# Altium schematic sheet Steering Wheel Interface Digital Inputs.SchDoc: Steering Wheel Interface - Digital Inputs
size B; Organization: Midnight Sun Solar Rayce Car Team; Address1: University of Waterloo; Address2: 200 University Ave W; Address3: Waterloo, ON, Canada; Address4: N2L 3E9; DocumentNumber: 3; SheetNumber: 3; SheetTotal: 3; Website: www.uwmidsun.com; ProjectName: ProjectName
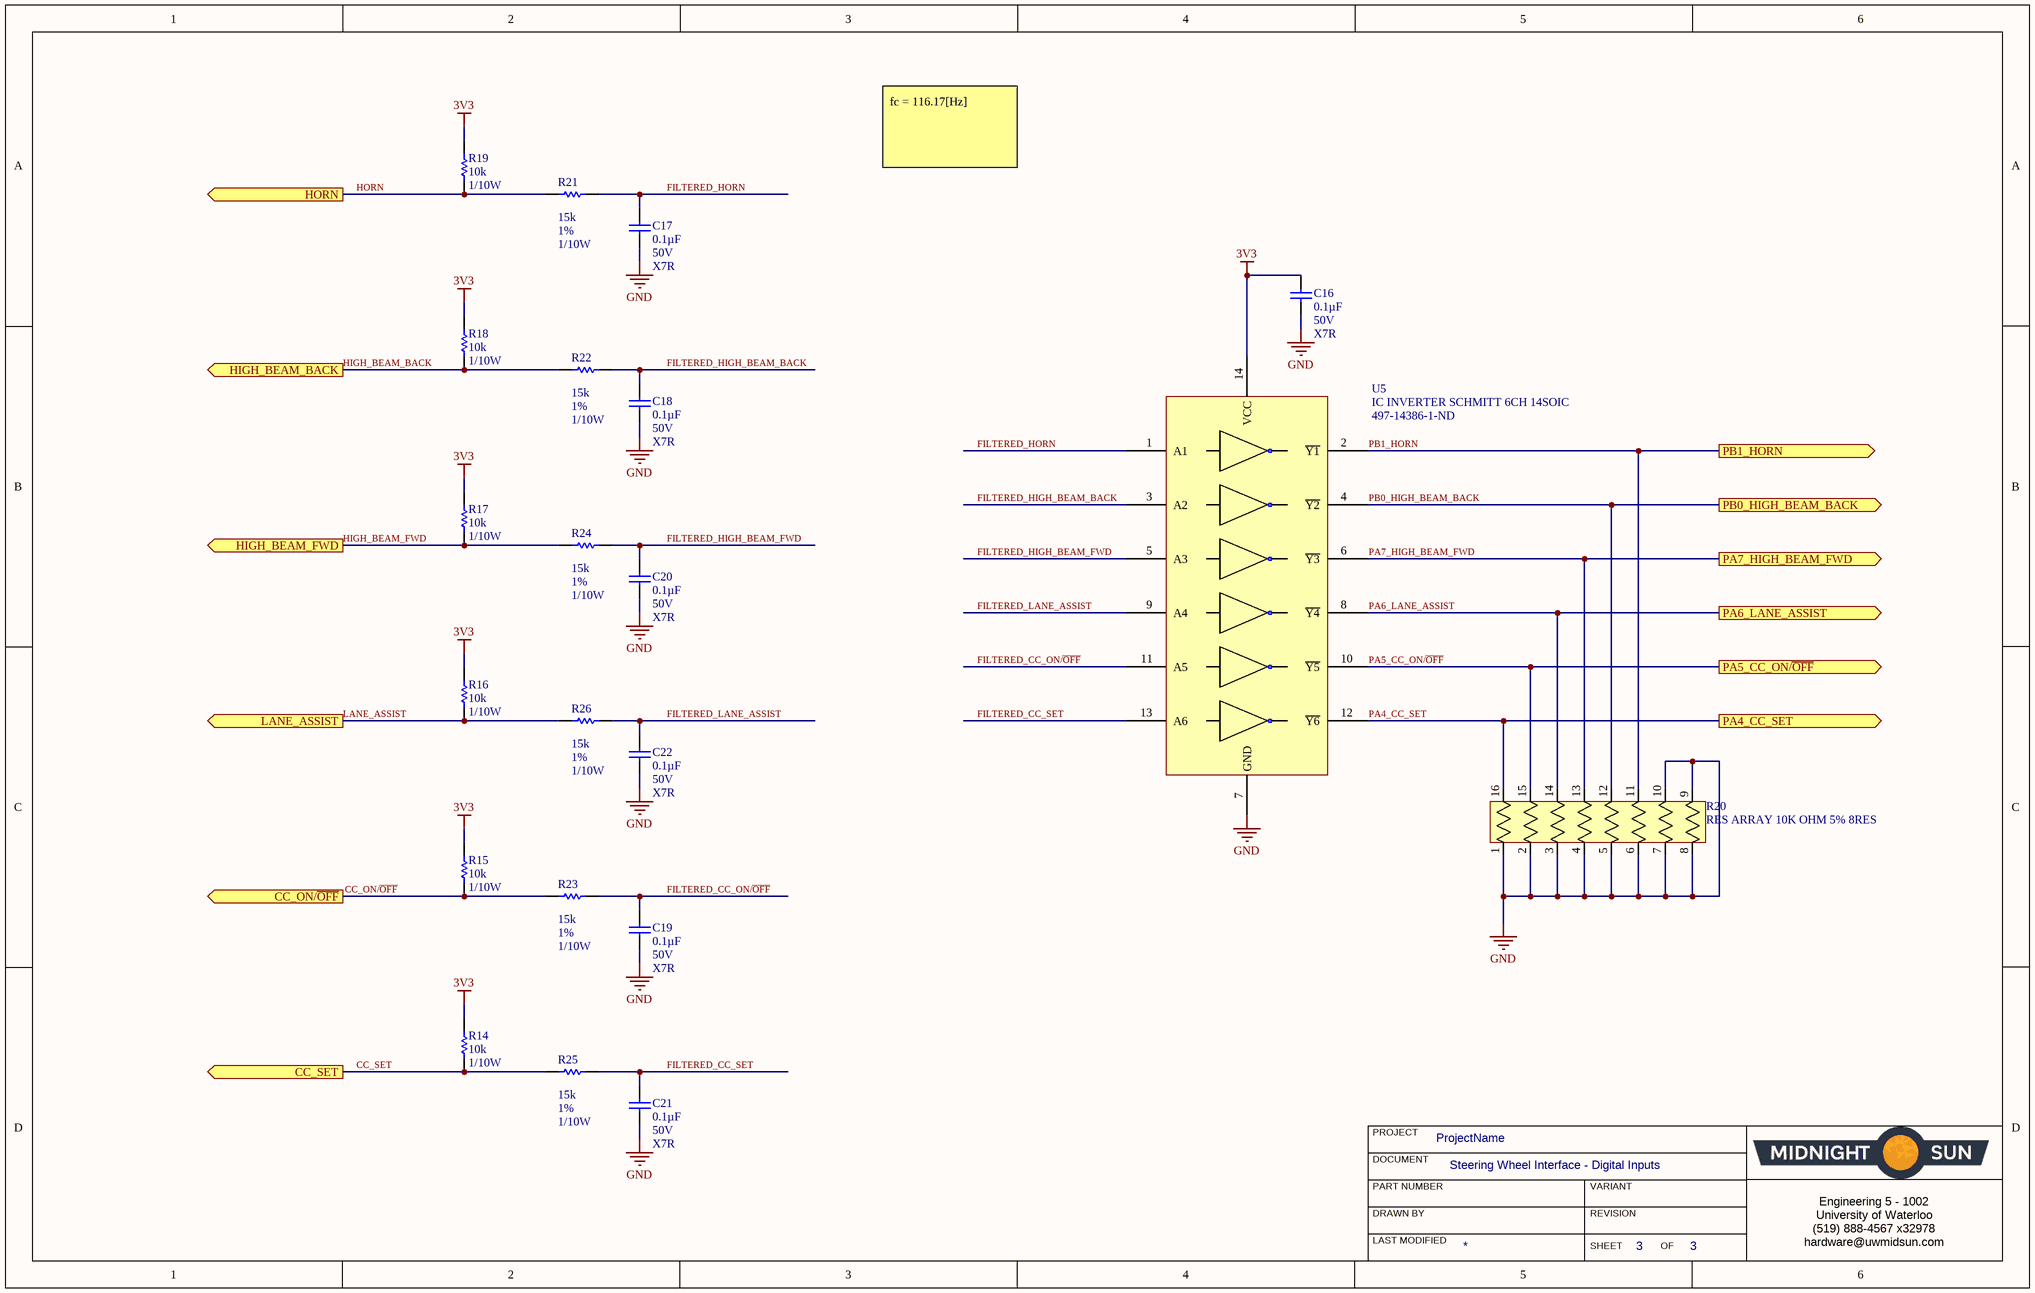
[diagram p0: Steering Wheel Interface Digital Inputs.SchDoc]

## Parts
C16  Capacitance: 0.1µF  Voltage: 50V  Temperature Coefficient: X7R  [CAP, 0603]  (hidden comment: CAP CER 0.1UF 50V 10% X7R 0603)
C17  Capacitance: 0.1µF  Voltage: 50V  Temperature Coefficient: X7R  [CAP, 0603]  (hidden comment: CAP CER 0.1UF 50V 10% X7R 0603)
C18  Capacitance: 0.1µF  Voltage: 50V  Temperature Coefficient: X7R  [CAP, 0603]  (hidden comment: CAP CER 0.1UF 50V 10% X7R 0603)
C19  Capacitance: 0.1µF  Voltage: 50V  Temperature Coefficient: X7R  [CAP, 0603]  (hidden comment: CAP CER 0.1UF 50V 10% X7R 0603)
C20  Capacitance: 0.1µF  Voltage: 50V  Temperature Coefficient: X7R  [CAP, 0603]  (hidden comment: CAP CER 0.1UF 50V 10% X7R 0603)
C21  Capacitance: 0.1µF  Voltage: 50V  Temperature Coefficient: X7R  [CAP, 0603]  (hidden comment: CAP CER 0.1UF 50V 10% X7R 0603)
C22  Capacitance: 0.1µF  Voltage: 50V  Temperature Coefficient: X7R  [CAP, 0603]  (hidden comment: CAP CER 0.1UF 50V 10% X7R 0603)
R14  Resistance: 10k  Power: 1/10W  [RES, 0603]  (hidden comment: RES 10K OHM 1% 1/10W 0603)
R15  Resistance: 10k  Power: 1/10W  [RES, 0603]  (hidden comment: RES 10K OHM 1% 1/10W 0603)
R16  Resistance: 10k  Power: 1/10W  [RES, 0603]  (hidden comment: RES 10K OHM 1% 1/10W 0603)
R17  Resistance: 10k  Power: 1/10W  [RES, 0603]  (hidden comment: RES 10K OHM 1% 1/10W 0603)
R18  Resistance: 10k  Power: 1/10W  [RES, 0603]  (hidden comment: RES 10K OHM 1% 1/10W 0603)
R19  Resistance: 10k  Power: 1/10W  [RES, 0603]  (hidden comment: RES 10K OHM 1% 1/10W 0603)
R20  RES ARRAY 10K OHM 5% 8RES  [RES ARRAY, 8 POS 1506]
R21  Resistance: 15k  Tolerance: 1%  Max Power Dissipation: 1/10W  [RES, 0603]  (hidden comment: RES SMD 15K OHM 1% 1/10W 0603)
R22  Resistance: 15k  Tolerance: 1%  Max Power Dissipation: 1/10W  [RES, 0603]  (hidden comment: RES SMD 15K OHM 1% 1/10W 0603)
R23  Resistance: 15k  Tolerance: 1%  Max Power Dissipation: 1/10W  [RES, 0603]  (hidden comment: RES SMD 15K OHM 1% 1/10W 0603)
R24  Resistance: 15k  Tolerance: 1%  Max Power Dissipation: 1/10W  [RES, 0603]  (hidden comment: RES SMD 15K OHM 1% 1/10W 0603)
R25  Resistance: 15k  Tolerance: 1%  Max Power Dissipation: 1/10W  [RES, 0603]  (hidden comment: RES SMD 15K OHM 1% 1/10W 0603)
R26  Resistance: 15k  Tolerance: 1%  Max Power Dissipation: 1/10W  [RES, 0603]  (hidden comment: RES SMD 15K OHM 1% 1/10W 0603)
U5  IC INVERTER SCHMITT 6CH 14SOIC  Supplier Part Number 1: 497-14386-1-ND  [IC INVERTER SCHMITT 6CH 14TSSOP]

## Ports
CC_ON/~{OFF} (out), CC_SET (out), HIGH_BEAM_BACK (out), HIGH_BEAM_FWD (out), HORN (out), LANE_ASSIST (out), PA4_CC_SET (out), PA5_CC_ON/~{OFF} (out), PA6_LANE_ASSIST (out), PA7_HIGH_BEAM_FWD (out), PB0_HIGH_BEAM_BACK (out), PB1_HORN (out)

## Nets
3V3: C16.1 R14.1 R15.1 R16.1 R17.1 R18.1 R19.1 U5.14(VCC)
GND: C16.2 C17.2 C18.2 C19.2 C20.2 C21.2 C22.2 R20.1 R20.2 R20.3 R20.4 R20.5 R20.6 R20.7 R20.8 R20.9 R20.10 U5.7(GND)
CC_ON/~{OFF}: R15.2 R23.2 ; port CC_ON/~{OFF}
CC_SET: R14.2 R25.2 ; port CC_SET
FILTERED_CC_ON/~{OFF}: C19.1 R23.1 U5.11(A5)
FILTERED_CC_SET: C21.1 R25.1 U5.13(A6)
FILTERED_HIGH_BEAM_BACK: C18.1 R22.1 U5.3(A2)
FILTERED_HIGH_BEAM_FWD: C20.1 R24.1 U5.5(A3)
FILTERED_HORN: C17.1 R21.1 U5.1(A1)
FILTERED_LANE_ASSIST: C22.1 R26.1 U5.9(A4)
HIGH_BEAM_BACK: R18.2 R22.2 ; port HIGH_BEAM_BACK
HIGH_BEAM_FWD: R17.2 R24.2 ; port HIGH_BEAM_FWD
HORN: R19.2 R21.2 ; port HORN
LANE_ASSIST: R16.2 R26.2 ; port LANE_ASSIST
PA4_CC_SET: R20.16 U5.12(~{Y6}) ; port PA4_CC_SET
PA5_CC_ON/~{OFF}: R20.15 U5.10(~{Y5}) ; port PA5_CC_ON/~{OFF}
PA6_LANE_ASSIST: R20.14 U5.8(~{Y4}) ; port PA6_LANE_ASSIST
PA7_HIGH_BEAM_FWD: R20.13 U5.6(~{Y3}) ; port PA7_HIGH_BEAM_FWD
PB0_HIGH_BEAM_BACK: R20.12 U5.4(~{Y2}) ; port PB0_HIGH_BEAM_BACK
PB1_HORN: R20.11 U5.2(~{Y1}) ; port PB1_HORN

## Notes on the sheet
- fc = 116.17[Hz]
- PROJECT
- DOCUMENT
- DRAWN BY
- LAST MODIFIED
- PART NUMBER
- REVISION
- SHEET
- VARIANT
- OF
- Engineering 5 - 1002
  University of Waterloo
  (519) 888-4567 x32978
  hardware@uwmidsun.com

## Library data of the parts
C16-C22 = CAP CER 0.1UF 50V 10% X7R 0603: 0.10µF ±10% 50V Ceramic Capacitor X7R 0603 (1608 Metric); Manufacturer 1: AVX Corporation; Manufacturer Part Number 1: 06035C104KAT2A; Supplier 1: Digi-Key; Supplier Part Number 1: 478-5052-1-ND; Packaging: Cut Tape (CT); Part Status: Active; Operating Temperature: -55°C ~ 125°C; Ratings: -; Mounting Type: Surface Mount, MLCC; Package / Case: 0603 (1608 Metric); Size / Dimension: 0.063" L x 0.032" W (1.60mm x 0.81mm); Height - Seated (Max): -; Thickness (Max): 0.035" (0.90mm); Lead Spacing: -; Lead Style: -; ComponentLink1URL: http://datasheets.avx.com/X7RDielectric.pdf; ComponentLink1Description: http://datasheets.avx.com/X7RDielectric.pdf; Tolerance: ±10%
R14-R19 = RES 10K OHM 1% 1/10W 0603: RES SMD 10K OHM 1% 1/10W 0603; Manufacturer 1: Yageo; Manufacturer Part Number 1: RC0603FR-0710KL; Temperature Coefficient: ±100ppm/°C; Supplier 1: Digi-Key; Supplier Part Number 1: 311-10.0KHRCT-ND; Packaging: Cut Tape (CT); Part Status: Active; Composition: Thick Film; Operating Temperature: -55°C ~ 155°C; Package / Case: 0603 (1608 Metric); Supplier Device Package: 0603; Size / Dimension: 0.063" L x 0.031" W (1.60mm x 0.80mm); Height - Seated (Max): 0.022" (0.55mm); Failure Rate: -; ComponentLink1URL: http://www.yageo.com/documents/recent/PYu-RC_Group_51_RoHS_L_7.pdf; ComponentLink1Description: http://www.yageo.com/documents/recent/PYu-RC_Group_51_RoHS_L_7.pdf; Tolerance: ±1%
R20 = RES ARRAY 10K OHM 5% 8RES EXB-2HV103JV: RES ARRAY SMD 10K 5% 62.5mW 1506; Manufacturer: Panasonic Electronic Components; Vendor: Panasonic; C: Copyright (C) 2015 Accelerated Designs. All rights reserved; Circuit Type: Isolated; Temperature Coefficient: ±200ppm/°C; Value: Value; Copyright: Copyright (C) 2015 Accelerated Designs. All rights reserved; Manufacturer_Part_Number: EXB-2HV103JV; Supplier 1: Digi-Key; Manufacturer Part Number: EXB-2HV103JV; RoHS: RoHS Compliant; Category: Resistors; Stock 1: 152779; Pricing 1: 1=0.43, 10=0.373, 25=0.2712, 50=0.1964, 100=0.1456, 250=0.11176, 500=0.08806, 1000=0.06096 (CAD); Packaging: Cut Tape (CT); Part Status: Active; Resistance (Ohms): 10k; Tolerance: ±5%; Power Per Element: 62.5mW; Operating Temperature: -55°C ~ 125°C; Applications: Automotive AEC-Q200; Mounting Type: Surface Mount; Package / Case: 1506, Convex, Long Side Terminals; Supplier Device Package: 1506; Size / Dimension: 0.150" L x 0.063" W (3.80mm x 1.60mm); Height - Seated (Max): 0.022" (0.55mm); ComponentLink1URL: https://industrial.panasonic.com/cdbs/www-data/pdf/AOC0000/AOC0000C14.pdf; ComponentLink1Description: https://industrial.panasonic.com/cdbs/www-data/pdf/AOC0000/AOC0000C14.pdf; Supplier Part Number 1: Y1103CT-ND
R21-R26 = RES SMD 15K OHM 1% 1/10W 0603: 15 kOhms ±1% 0.1W, 1/10W Chip Resistor 0603 (1608 Metric) Moisture Resistant Thick Film; Manufacturer: Yageo; Manufacturer Part Number: RC0603FR-0715KL; Power Rating: 100mW; Voltage Rating: 50V; Temperature Coefficient: 100ppm/°C; Case/Package: 0603; Case Code (Imperial): 0603; Case Code (Metric): 1608; Min Operating Temperature: -55°C; Max Operating Temperature: 155°C; Packaging: Tape and Reel; Termination: SMD/SMT; Composition: Thick Film; Military Standard: Not; Voltage Rating (DC): 50V; Length: 1.6mm; Height: 0.022inch; Width: 0.031inch; Depth: 0.8mm; Lead Free: Lead Free; ComponentLink1URL: https://www.digikey.ca/product-detail/en/yageo/RC0603FR-0715KL/311-15.0KHRCT-ND/729900; ComponentLink1Description: Digikey; Features: Moisture Resistant; Number of Pins: 2; Number of Terminations: 2; Package Quantity: 1; REACH SVHC: Unknown; Supplier 1: Digi-Key; RoHS: Yes; Stock 1: 8611420; Pricing 1: 1 = 0.10000, 10 = 0.02400, 100 = 0.00970, 1000 = 0.00437, 2500 = 0.00379 (USD); ComponentLink2URL: http://www.yageo.com/documents/recent/PYu-RC_Group_51_RoHS_L_10.pdf; ComponentLink2Description: http://www.yageo.com/documents/recent/PYu-RC_Group_51_RoHS_L_10.pdf; ComponentLink3URL: http://www.yageo.com/documents/recent/PYu-RC_Group_51_RoHS_L_9.pdf; ComponentLink3Description: http://www.yageo.com/documents/recent/PYu-RC_Group_51_RoHS_L_9.pdf; ComponentLink4URL: https://www.verical.com/server-webapp/html/getDatasheet?partID=327895; ComponentLink4Description: https://www.verical.com/server-webapp/html/getDatasheet?partID=327895; Supplier Part Number 1: 311-15.0KHRCT-ND
U5 = IC INVERTER SCHMITT 6CH 14TSSOP: Inverter IC 6 Channel Schmitt Trigger 14-SOIC; Manufacturer: STMicroelectronics; Manufacturer Part Number: M74HC14YRM13TR; Number of Inputs: 6; Propagation Delay: 21ns; Max Supply Voltage: 6V; Min Supply Voltage: 2V; Quiescent Current: 1uA; High Level Output Current: -5.2mA; Low Level Output Current: 5.2mA; Turn-On Delay Time: 190ns; ComponentLink1Description: Digikey; ComponentLink1URL: https://www.digikey.ca/product-detail/en/stmicroelectronics/M74HC14YTTR/497-14387-1-ND/4725844; Supplier 1: Digi-Key; RoHS: Yes; Stock 1: 28888; Pricing 1: 1 = 0.48000, 10 = 0.41300, 100 = 0.30860, 500 = 0.24246, 1000 = 0.18736 (USD); Mount: Surface Mount; Case/Package: SO; Number of Pins: 14; Weight: 0.009143oz; Min Operating Temperature: -40°C; Max Operating Temperature: 125°C; Packaging: Tape and Reel; Package Quantity: 2500; Logic Function: Inverter; Number of Circuits: 6; ComponentLink2URL: http://www.st.com/content/ccc/resource/technical/document/datasheet/19/a3/52/42/dd/ab/4b/46/CD00000263.pdf/files/CD00000263.pdf/jcr:content/translations/en.CD00000263.pdf; ComponentLink2Description: http://www.st.com/content/ccc/resource/technical/document/datasheet/19/a3/52/42/dd/ab/4b/46/CD00000263.pdf/files/CD00000263.pdf/jcr:content/translations/en.CD00000263.pdf; ComponentLink3URL: http://www.st.com/st-web-ui/static/active/en/resource/technical/document/datasheet/CD00000263.pdf; ComponentLink3Description: http://www.st.com/st-web-ui/static/active/en/resource/technical/document/datasheet/CD00000263.pdf; ComponentLink4Description: http://www.st.com/content/ccc/resource/technical/document/datasheet/19/a3/52/42/dd/ab/4b/46/CD00000263.pdf/files/CD00000263.pdf/jcr:content/translations/en.CD00000263.pdf?src-supplier=Digi-Key; ComponentLink4URL: http://www.st.com/content/ccc/resource/technical/document/datasheet/19/a3/52/42/dd/ab/4b/46/CD00000263.pdf/files/CD00000263.pdf/jcr:content/translations/en.CD00000263.pdf?src-supplier=Digi-Key; ComponentLink5Description: http://www.st.com/st-web-ui/static/active/en/resource/technical/document/datasheet/CD00000263.pdf?src-supplier=Avnet; ComponentLink5URL: http://www.st.com/st-web-ui/static/active/en/resource/technical/document/datasheet/CD00000263.pdf?src-supplier=Avnet; Number of Elements: 6